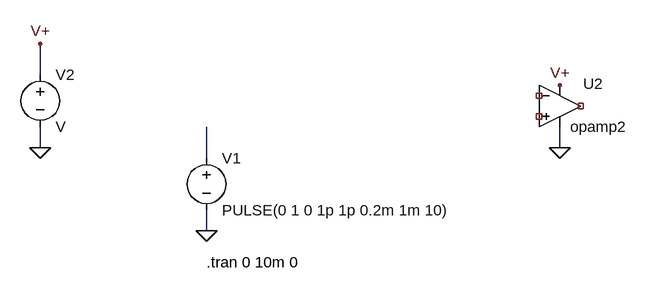
[diagram p0: schematic Draft1.asc]
Draft1.asc, the LTspice schematic file:
Version 4
SHEET 1 880 680
WIRE -160 -16 -160 -64
WIRE -160 96 -160 64
WIRE 640 96 640 64
WIRE 96 112 96 64
WIRE 96 224 96 192
FLAG 96 224 0
FLAG 640 96 0
FLAG -160 96 0
FLAG -160 -64 V+
FLAG 640 0 V+
SYMBOL voltage 96 96 R0
WINDOW 123 0 0 Left 2
WINDOW 39 0 0 Left 2
SYMATTR InstName V1
SYMATTR Value PULSE(0 1 0 1p 1p 0.2m 1m 10)
SYMBOL Opamps\\opamp2 640 -32 R0
WINDOW 0 36 30 Left 2
SYMATTR InstName U2
SYMBOL voltage -160 -32 R0
SYMATTR InstName V2
TEXT 96 272 Left 2 !.tran 0 10m 0

The netlist it stands for:
* Draft1.asc
V1 N001 0 PULSE(0 1 0 1p 1p 0.2m 1m 10)
XU2 NC_01 NC_02 V+ 0 NC_03 opamp2  ; pins In+ In- V+ V- OUT
V2 V+ 0 V
.tran 0 10m 0
.backanno
.end